# EAGLE design IN-12B Clock (EAGLE 8.1.0)
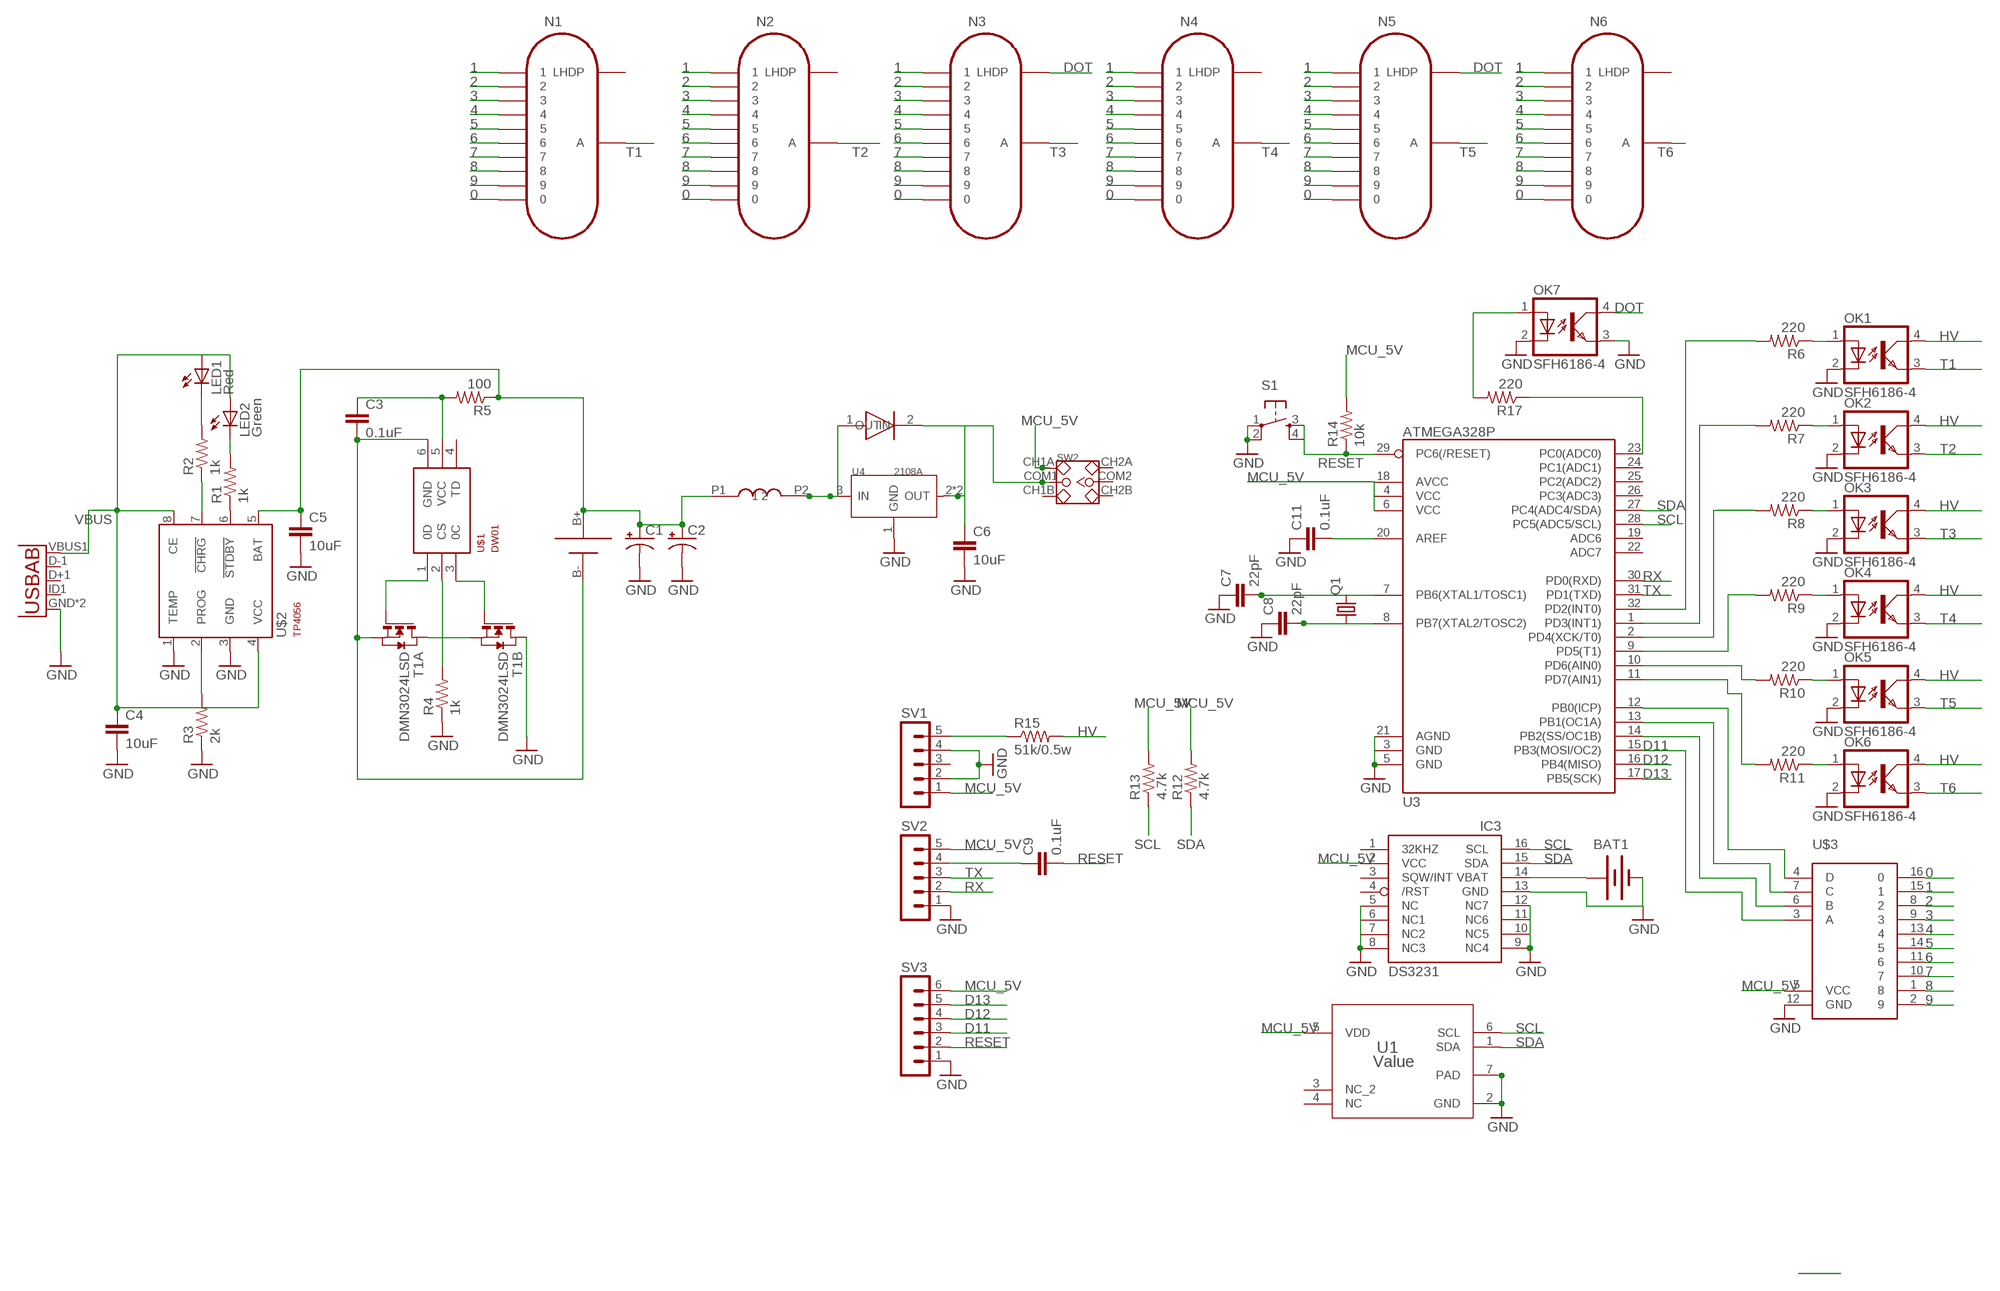
[diagram p0: schematic, sheet 1, part 1 of 2]
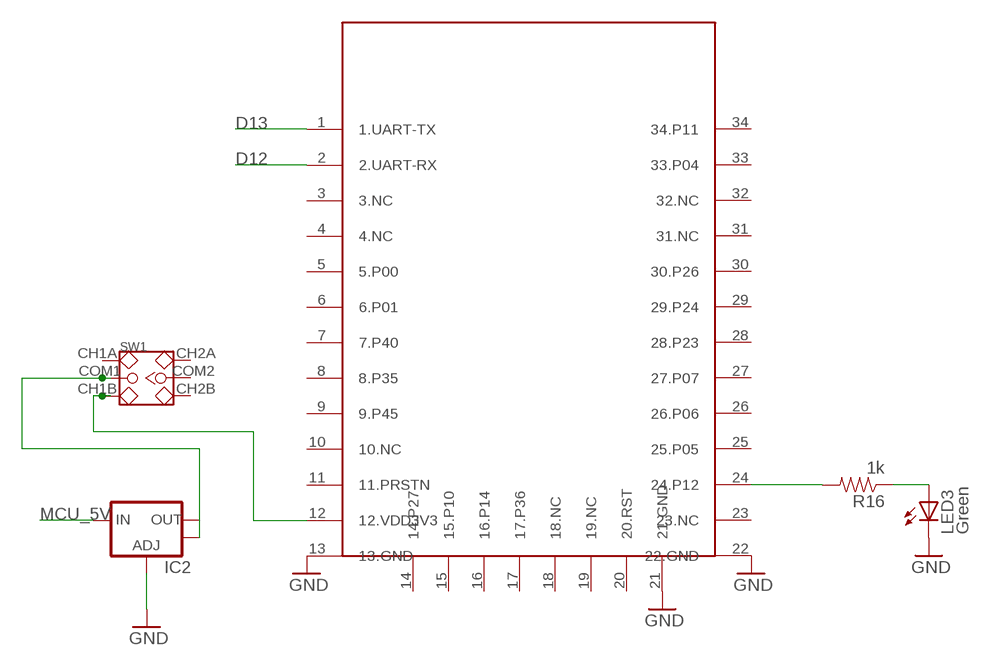
[diagram p1: schematic, sheet 1, part 2 of 2]

## Parts
BAT1  BATTERY20PTH  [BATTCOM_20MM_PTH]
C1  CAP_POLF80  [NIPPON_F80]
C2  CAP_POLF80  [NIPPON_F80]
C3  0.1uF  0.1UF-25V-5%(0603)  [0603-CAP]
C4  10uF  0.1UF-25V-5%(0603)  [0603-CAP]
C5  10uF  0.1UF-25V-5%(0603)  [0603-CAP]
C6  10uF  0.1UF-25V-5%(0603)  [0603-CAP]
C7  22pF  0.1UF-25V-5%(0603)  [0603-CAP]
C8  22pF  0.1UF-25V-5%(0603)  [0603-CAP]
C9  0.1uF  0.1UF-25V-5%(0603)  [0603-CAP]
C11  0.1uF  0.1UF-25V-5%(0603)  [0603-CAP]
IC2  V_REG_LM1117SOT223  [SOT223]
IC3  DS3231/SO  [SO16W]
LED1  Red  LEDCHIP-LED0805  [CHIP-LED0805]
LED2  Green  LEDCHIP-LED0805  [CHIP-LED0805]
LED3  Green  LEDCHIP-LED0805  [CHIP-LED0805]
N1  IN-12B  [IN-12]
N2  IN-12B  [IN-12]
N3  IN-12B  [IN-12]
N4  IN-12B  [IN-12]
N5  IN-12B  [IN-12]
N6  IN-12B  [IN-12]
OK1  SFH6186-4  [SMD4-7]
OK2  SFH6186-4  [SMD4-7]
OK3  SFH6186-4  [SMD4-7]
OK4  SFH6186-4  [SMD4-7]
OK5  SFH6186-4  [SMD4-7]
OK6  SFH6186-4  [SMD4-7]
OK7  SFH6186-4  [SMD4-7]
Q1  CRYSTALSM49  [SM49]
R1  1k  1.2MOHMS-1/10W-1%(0603)  [0603-RES]
R2  1k  1.2MOHMS-1/10W-1%(0603)  [0603-RES]
R3  2k  1.2MOHMS-1/10W-1%(0603)  [0603-RES]
R4  1k  1.2MOHMS-1/10W-1%(0603)  [0603-RES]
R5  100  1.2MOHMS-1/10W-1%(0603)  [0603-RES]
R6  220  1.2MOHMS-1/10W-1%(0603)  [0603-RES]
R7  220  1.2MOHMS-1/10W-1%(0603)  [0603-RES]
R8  220  1.2MOHMS-1/10W-1%(0603)  [0603-RES]
R9  220  1.2MOHMS-1/10W-1%(0603)  [0603-RES]
R10  220  1.2MOHMS-1/10W-1%(0603)  [0603-RES]
R11  220  1.2MOHMS-1/10W-1%(0603)  [0603-RES]
R12  4.7k  1.2MOHMS-1/10W-1%(0603)  [0603-RES]
R13  4.7k  1.2MOHMS-1/10W-1%(0603)  [0603-RES]
R14  10k  1.2MOHMS-1/10W-1%(0603)  [0603-RES]
R15  51k/0.5w  R-US_0207/12  [0207/12]
R16  1k  1.2MOHMS-1/10W-1%(0603)  [0603-RES]
R17  220  1.2MOHMS-1/10W-1%(0603)  [0603-RES]
S1  TAC_SWITCHSMD  [TACTILE_SWITCH_SMD]
SV1  MA05-1  [MA05-1]
SV2  MA05-1  [MA05-1]
SV3  MA06-1  [MA06-1]
SW1  SMD-TOGGLE-SWITCH-2CH(2X3P-7X3.5MM)  [SW6-2.54-SMD-7.0X3.5X1.5MM]
SW2  SMD-TOGGLE-SWITCH-2CH(2X3P-7X3.5MM)  [SW6-2.54-SMD-7.0X3.5X1.5MM]
T1  DMN3024LSD  [TSSOP-8]
U1  Value  HDC1080DMBR  [DMB0006A]
U2  USB""  [USB-MICRO-SMD]
U3  ATMEGA328P  ATMEGA328_SMT  [TQFP32-08]
U4  2108A  PMIC-CJA1117B-3.3(SOT-89)  [SOT-89]
U$1  DW01  [SOT23-6]
U$2  TP4056  [SOT23-8]
U$3  K155ID1  [DIL16-KIT]
U$4  SPP-CA  [SPP-CA]
U$5  22uH  CD54  [CD54]
U$6  SS14  SMA-SS34  [SMA-SS34]
U$7  18650SMD  [18650SMD]

## Nets
0: N1.0 N2.0 N3.0 N4.0 N5.0 N6.0 U$3.16
1: N1.1 N2.1 N3.1 N4.1 N5.1 N6.1 U$3.15
2: N1.2 N2.2 N3.2 N4.2 N5.2 N6.2 U$3.8
3: N1.3 N2.3 N3.3 N4.3 N5.3 N6.3 U$3.9
4: N1.4 N2.4 N3.4 N4.4 N5.4 N6.4 U$3.13
5: N1.5 N2.5 N3.5 N4.5 N5.5 N6.5 U$3.14
6: N1.6 N2.6 N3.6 N4.6 N5.6 N6.6 U$3.11
7: N1.7 N2.7 N3.7 N4.7 N5.7 N6.7 U$3.10
8: N1.8 N2.8 N3.8 N4.8 N5.8 N6.8 U$3.1
9: N1.9 N2.9 N3.9 N4.9 N5.9 N6.9 U$3.2
D11: SV3.3 U3.15(PB3(MOSI/OC2)) U$3.3(A)
D12: SV3.4 U3.16(PB4(MISO)) U$4.2(2.UART-RX)
D13: SV3.5 U3.17(PB5(SCK)) U$4.1(1.UART-TX)
DOT: N3.LHDP N5.LHDP OK7.4(COL)
GND: BAT1.2(-) C1.- C2.- C4.2 C5.2 C6.2 C7.1 C8.1 C11.1 IC2.1(ADJ) IC3.5(NC) IC3.6(NC1) IC3.7(NC2) IC3.8(NC3) IC3.9(NC4) IC3.10(NC5) IC3.11(NC6) IC3.12(NC7) IC3.13(GND) LED3.C OK1.2(C) OK2.2(C) OK3.2(C) OK4.2(C) OK5.2(C) OK6.2(C) OK7.2(C) OK7.3(EMIT) R3.1 R4.1 S1.1 S1.2 SV1.2 SV1.4 SV2.1 SV3.1 T1.8(B:D) U1.2(GND) U1.7(PAD) U2.GND U2.GND1(GND) U3.3(GND) U3.5(GND) U3.21(AGND) U4.1(GND) U$2.1(TEMP) U$2.3(GND) U$3.12(GND) U$4.13(13.GND) U$4.21(21.GND) U$4.22(22.GND)
HV: OK1.4(COL) OK2.4(COL) OK3.4(COL) OK4.4(COL) OK5.4(COL) OK6.4(COL) R15.2
MCU_5V: IC2.3(IN) IC3.2(VCC) R12.2 R13.2 R14.2 SV1.1 SV2.5 SV3.6 SW2.CH1A U1.5(VDD) U3.4(VCC) U3.6(VCC) U3.18(AVCC) U$3.5(VCC)
N$1: LED2.C R1.2
N$2: R1.1 U$2.6(!STDBY)
N$3: LED1.C R2.2
N$4: R2.1 U$2.7(!CHRG)
N$5: R3.2 U$2.2(PROG)
N$6: U4.3(IN) U$5.P2 U$6.1(IN)
N$7: C6.1 SW2.COM1 U4.2(OUT) U4.4(OUT) U$6.2(OUT)
N$8: T1.1(A:D) T1.6(B:S) T1.7(B:S)
N$9: T1.4(A:G) U$1.1(0D)
N$10: T1.5(B:G) U$1.3(0C)
N$11: R4.2 U$1.2(CS)
N$12: C3.2 T1.2(A:S) T1.3(A:S) U$1.6(GND) U$7.B-
N$13: C3.1 R5.2 U$1.5(VCC)
N$14: C1.+ C2.+ C5.1 R5.1 U$2.5(BAT) U$5.P1 U$7.B+
N$15: C7.2 Q1.2 U3.7(PB6(XTAL1/TOSC1))
N$16: C8.2 Q1.1 U3.8(PB7(XTAL2/TOSC2))
N$17: BAT1.1(+) IC3.14(VBAT)
N$18: C11.2 U3.20(AREF)
N$19: R15.1 SV1.5
N$22: OK1.1(A) R6.1
N$23: OK2.1(A) R7.1
N$24: OK3.1(A) R8.1
N$25: OK4.1(A) R9.1
N$26: OK5.1(A) R10.1
N$27: OK6.1(A) R11.1
N$28: R6.2 U3.32(PD2(INT0))
N$29: R7.2 U3.1(PD3(INT1))
N$30: R8.2 U3.2(PD4(XCK/T0))
N$31: R9.2 U3.9(PD5(T1))
N$32: R10.2 U3.10(PD6(AIN0))
N$33: R11.2 U3.11(PD7(AIN1))
N$34: U3.12(PB0(ICP)) U$3.4(D)
N$35: U3.13(PB1(OC1A)) U$3.7(C)
N$36: U3.14(PB2(SS/OC1B)) U$3.6(B)
N$37: R17.1 U3.23(PC0(ADC0))
N$38: IC2.2(OUT) IC2.4(OUT) SW1.COM1
N$39: SW1.CH1B U$4.12(12.VDD3V3)
N$40: OK7.1(A) R17.2
N$41: C9.1 SV2.4
N$42: R16.2 U$4.24(24.P12)
N$43: LED3.A R16.1
RESET: C9.2 R14.1 S1.3 S1.4 SV3.2 U3.29(PC6(/RESET))
RX: SV2.2 U3.30(PD0(RXD))
SCL: IC3.16(SCL) R13.1 U1.6(SCL) U3.28(PC5(ADC5/SCL))
SDA: IC3.15(SDA) R12.1 U1.1(SDA) U3.27(PC4(ADC4/SDA))
T1: N1.A OK1.3(EMIT)
T2: N2.A OK2.3(EMIT)
T3: N3.A OK3.3(EMIT)
T4: N4.A OK4.3(EMIT)
T5: N5.A OK5.3(EMIT)
T6: N6.A OK6.3(EMIT)
TX: SV2.3 U3.31(PD1(TXD))
VBUS: C4.1 LED1.A LED2.A U2.VBUS1(VBUS) U$2.4(VCC) U$2.8(CE)
Unconnected: IC3.1(32KHZ) IC3.3(SQW/INT) IC3.4(/RST) N1.LHDP N2.LHDP N4.LHDP N6.LHDP SV1.3 SW1.CH1A SW1.CH2A SW1.CH2B SW1.COM2 SW2.CH1B SW2.CH2A SW2.CH2B SW2.COM2 U1.3(NC_2) U1.4(NC) U2.D+1(D+) U2.D-1(D-) U2.ID1(USBID) U3.19(ADC6) U3.22(ADC7) U3.24(PC1(ADC1)) U3.25(PC2(ADC2)) U3.26(PC3(ADC3)) U$1.4(TD) U$4.3(3.NC) U$4.4(4.NC) U$4.5(5.P00) U$4.6(6.P01) U$4.7(7.P40) U$4.8(8.P35) U$4.9(9.P45) U$4.10(10.NC) U$4.11(11.PRSTN) U$4.14(14.P27) U$4.15(15.P10) U$4.16(16.P14) U$4.17(17.P36) U$4.18(18.NC) U$4.19(19.NC) U$4.20(20.RST) U$4.23(23.NC) U$4.25(25.P05) U$4.26(26.P06) U$4.27(27.P07) U$4.28(28.P23) U$4.29(29.P24) U$4.30(30.P26) U$4.31(31.NC) U$4.32(32.NC) U$4.33(33.P04) U$4.34(34.P11)

## Library data of the parts
BAT1 = SparkFun-Electromechanical:BATTERY: Battery Holders Various common sizes : AA, AAA, 20mm coin cell and 12mm coin cell. 20MM_4LEGS, BATT-10373
C1 C2 = SparkFun-Capacitors:CAP_POL: Capacitor Polarized These are standard SMD and PTH capacitors. Normally 10uF, 47uF, and 100uF in electrolytic and tantalum varieties. Always verify the external diameter of the through hole cap, it varies with capacity, voltage, and manufacturer. The EIA devices should be standard.
C3 C9 C11 = SparkFun-Capacitors:0.1UF-25V-5%(0603): CAP-08604; PROD_ID: CAP-08604
C4-C8 = SparkFun-Capacitors:0.1UF-25V-5%(0603): CAP-08604; PROD_ID: CAP-08604; VALUE: 0.1uF
IC2 = SparkFun-PowerIC:V_REG_LM1117: Voltage Regulator LM1117 Standard adjustable voltage regulator but in SMD form. Spark Fun Electronics SKU : COM-00595
IC3 = adafruit:DS3231
LED1-LED3 = adafruit:LED: LED OSRAM: - CHIPLED LG R971, LG N971, LY N971, LG Q971, LY Q971, LO R971, LY R971 LH N974, LH R974 LS Q976, LO Q976, LY Q976 LO Q996 - Hyper CHIPLED LW Q18S LB Q993, LB Q99A, LB R99A - SideLED LS A670, LO A670, LY A670, LG A670, LP A670 LB A673, LV A673, LT A673, LW A673 LH A674 LY A675 LS A676, LA A676, LO A676, LY A676, LW A676 LS A679, LY A679, LG A679 - Hyper Micro SIDELED® LS Y876, LA Y876, LO Y876, LY Y876 LT Y87S - SmartLED LW L88C, LW L88S LB L89C, LB L89S, LG L890 LS L89K, LO L89K, LY L89K LS L896, LA L896, LO L896, LY L896 - TOPLED LS T670, LO T670, LY T670, LG T670, LP T670 LSG T670, LSP T670, LSY T670, LOP T670, LYG T670 LG T671, LOG T671, LSG T671 LB T673, LV T673, LT T673, LW T673 LH T674 LS T676, LA T676, LO T676, LY T676, LB T676, LH T676, LSB T676, LW T676 LB T67C, LV T67C, LT T67C, LS T67K, LO T67K, LY T67K, LW E67C LS E67B, LA E67B, LO E67B, LY E67B, LB E67C, LV E67C, LT E67C LW T67C LS T679, LY T679, LG T679 LS T770, LO T770, LY T770, LG T770, LP T770 LB T773, LV T773, LT T773, LW T773 LH T774 LS E675, LA E675, LY E675, LS T675 LS T776, LA T776, LO T776, LY T776, LB T776 LHGB T686 LT T68C, LB T68C - Hyper Mini TOPLED® LB M676 - Mini TOPLED Santana® LG M470 LS M47K, LO M47K, LY M47K Source: http://www.osram.convergy.de/
N1-N6 = russian-nixies:IN-12B: IN-12B: medium numeric topview nixie tube
OK1-OK7 = optocoupler:SFH618?*: Optocoupler, Phototransistor Output, Low Input Current Source: Data sheet <http://www.vishay.com/docs/83673/sfh618.pdf>; MF: VISHAY/TELEFUNKEN; MPN: SFH6186-4; OC_FARNELL: 1469530; OC_NEWARK: 21H7753
Q1 = adafruit:CRYSTAL: CRYSTAL; OC_FARNELL: unknown; OC_NEWARK: unknown
R1-R14 R16 R17 = SparkFun-Resistors:1.2MOHMS-1/10W-1%(0603): RES-10055; PROD_ID: RES-10055; VALUE: 1.2M
R15 = resistor:R-US_: RESISTOR, American symbol
S1 = SparkFun-Electromechanical:TAC_SWITCH: Momentary Switch Button commonly used for reset or general input. Spark Fun Electronics SKU : COM-00097 SMT- SWCH-08247; PROD_ID: SWCH-08247
SV1 SV2 = con-lstb:MA05-1: PIN HEADER; OC_FARNELL: unknown; OC_NEWARK: unknown
SV3 = con-lstb:MA06-1: PIN HEADER; OC_FARNELL: unknown; OC_NEWARK: unknown
SW1 SW2 = Seeed-OPL-Switch:SMD-TOGGLE-SWITCH-2CH(2X3P-7X3.5MM): 311030005
T1 = FS8205A:DMN3024LSD: DUAL N-CHANNEL ENHANCEMENT MODE MOSFET data sheet <http://goo.gl/dRgboR> Dave.Calaway Eagle Library <https://goo.gl/Muy1Tr>
U1 = HDC1080:HDC1080DMBR; ALTERNATEPARTNUMBER: HDC1080DMBT; APPLICATION_BUILDNUMBER: *; COMPTYPE: IC; MANUFACTURER: Texas Instruments; MOUNTTYPE: SMT; PACKAGEREFERENCE: DMB0006A; PARTNUMBER: HDC1080DMBR; PIN_COUNT: 7; REFDES: RefDes; TYPE: TYPE
U2 = MicroUSB Long:USB: This is a USB AB connector that is compatible with USB OTG. i.e. this connector can serve as a host or device
U3 = SparkFun-DigitalIC:ATMEGA328_SMT: 32-Pin Atmega328 part Commonly used on Arduino compatible boards Available in QFP and QFN packages TQFP is IC-09069 QFN is non-stock; PROD_ID: IC-09069
U4 = Seeed-OPL-ic:PMIC-CJA1117B-3.3(SOT-89): 310030095; MPN: CJA1117B-3.3; VALUE: CJA1117B-3.3-SOT89
U$1 = DW01:DW01: The DW01-P battery protection IC is designed to protect lithium-ion/polymer battery from damage or degrading the lifetime due to overcharge, overdischarge, and/or overcurrent for one-cell lithium-ion/polymer battery powered systems, such as cellular phones. Data sheet <http://goo.gl/4y108d> Dave.Calaway Eagle Library <https://goo.gl/Muy1Tr>
U$2 = TP4056:TP4056: TP4056 Data sheet <http://goo.gl/J7k8TF> Dave.Calaway Eagle Library <https://goo.gl/Muy1Tr>
U$3 = Nixie:K155ID1
U$4 = SPP-CA:SPP-CA
U$5 = CD54:CD54
U$6 = SMA-SS34:SMA-SS34
U$7 = 18650SMD:18650SMD

## Board
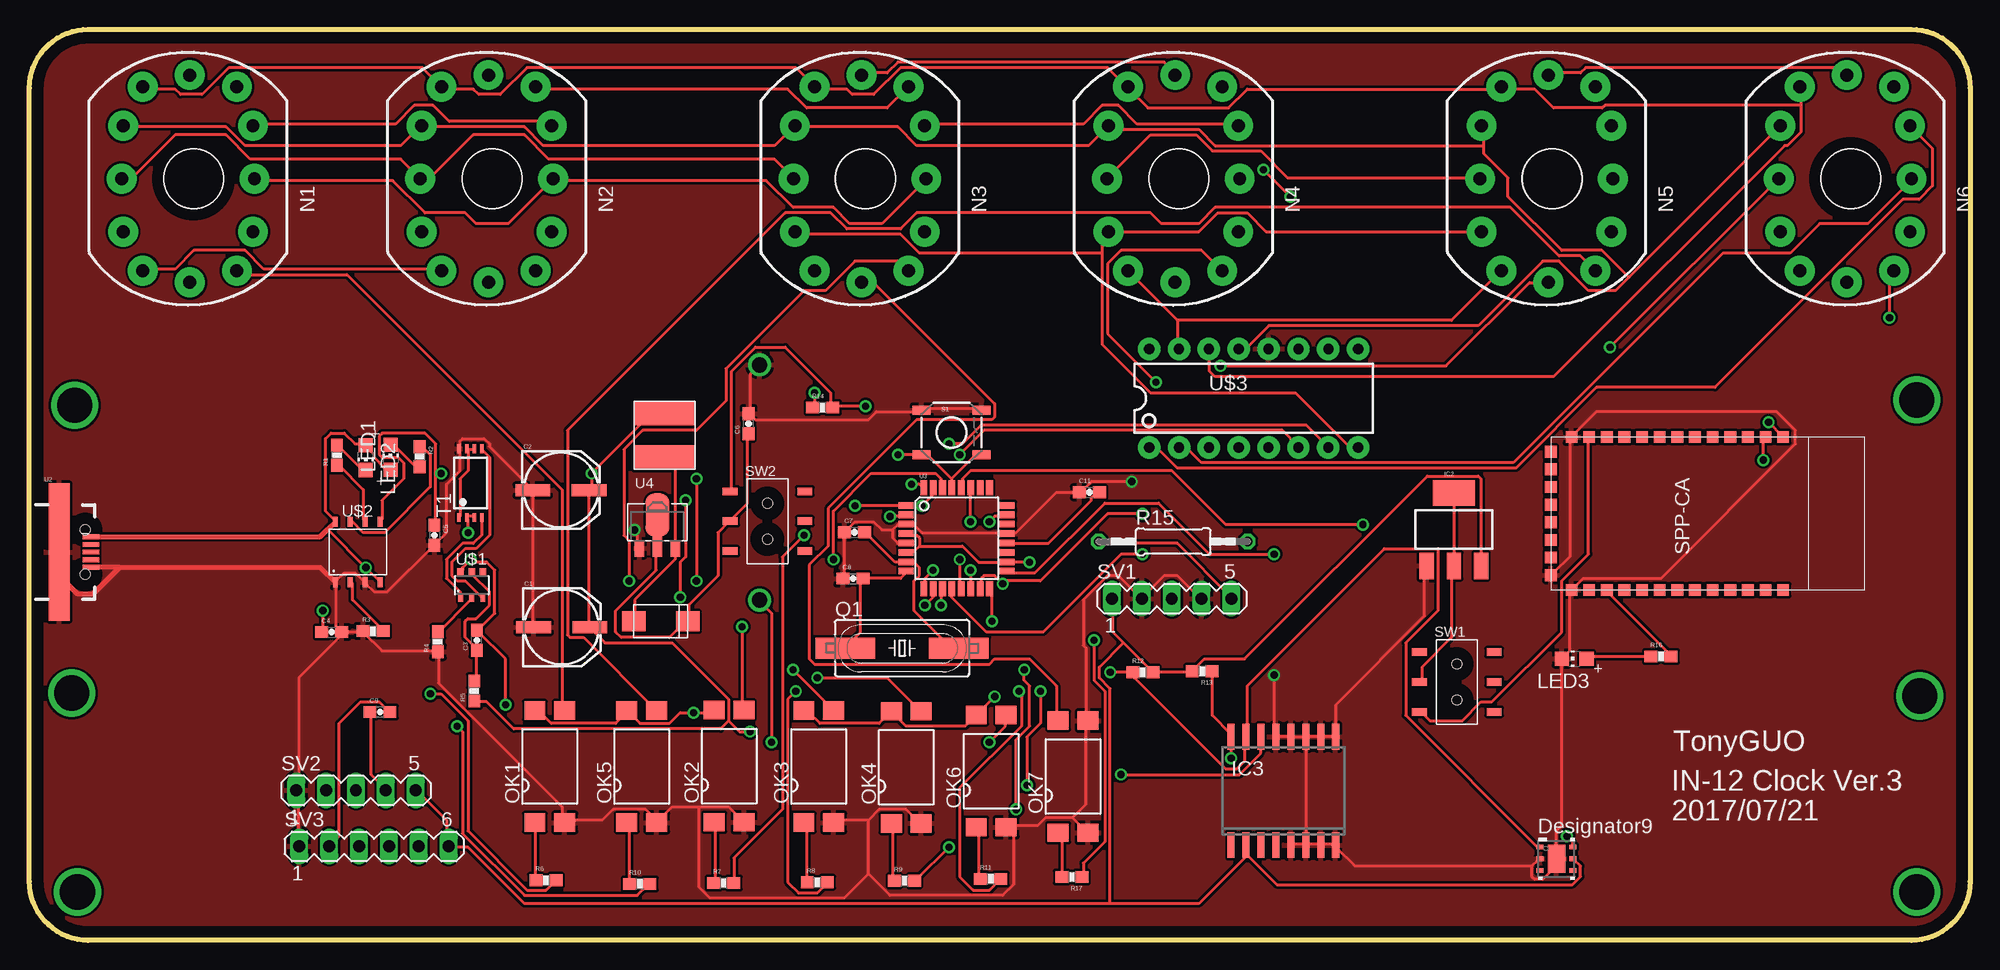
[diagram p2: board, top side]
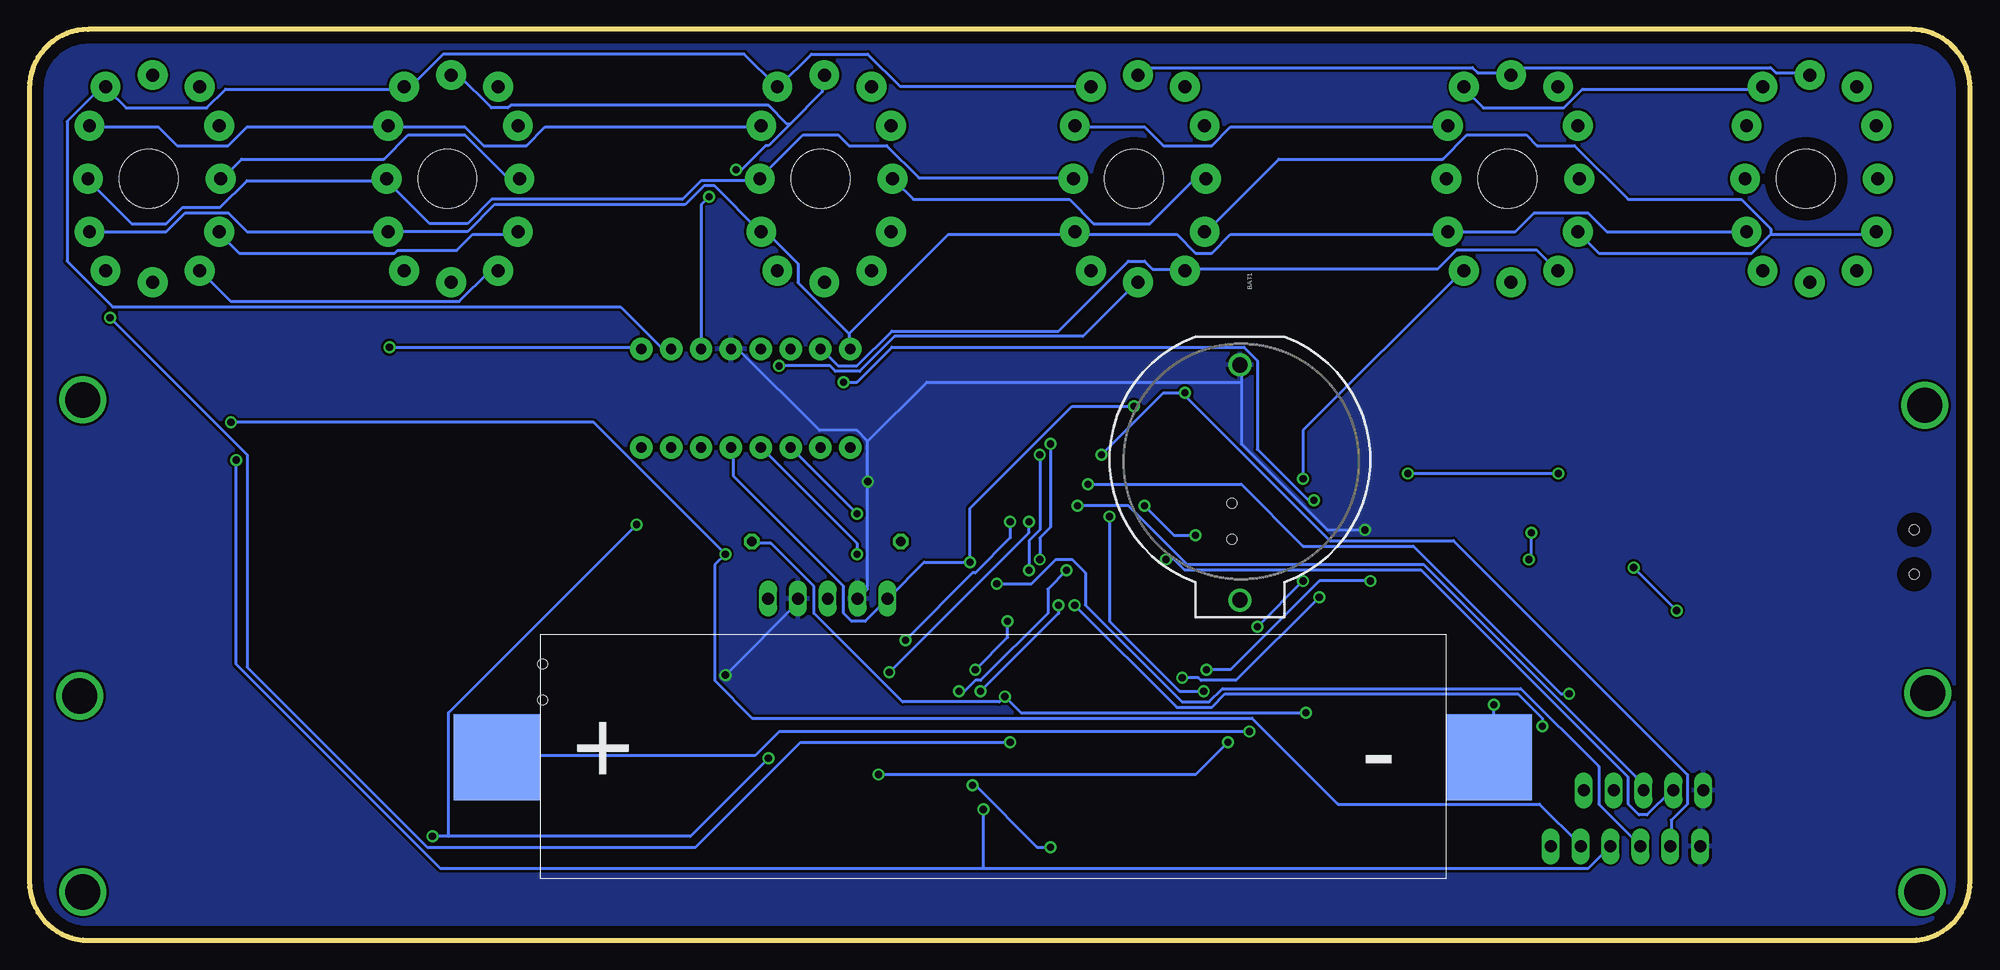
[diagram p3: board, bottom side, seen from below]

Size 165.1 x 77.47 mm. Coordinates in mm from the lower left corner, seen from the top.
Outline: 160.1,0 5,0 arc-90 0,5 0,72.47 arc-90 5,77.47 160.1,77.47 arc-90 165.1,72.47 165.1,5 arc-90 160.1,0
Copper layers (1*16): Top 0.035mm / dielectric 1.5mm / Bottom 0.035mm
Design rules "default": minimum track width 10mil, minimum drill 24mil, track to track 8mil, track to pad 8mil, pad to pad 8mil, via to via 8mil, smd to smd 8mil, copper to edge 40mil, drill to drill 8mil, minimum pad ring 10mil, minimum via ring 8mil, stop-mask expansion 4mil, vias tented up to drill 0mil, thermal gap 10mil

### Footprints (pad centres in the part's own frame; a part is rotated, then mirrored left to right if it is on the bottom)
BATTCOM_20MM_PTH = drill 1.3: 1 11.85,0; 2 -8.15,0
NIPPON_F80 = smd 2.95 x 1: + 2.4,0; - -2.4,0
0603-CAP = smd 1.1 x 1: 1 -0.85,0; 2 0.85,0
SOT223 = smd 1.219 x 2.235: 1 -2.311,-3.099; 2 0,-3.099; 3 2.311,-3.099 | smd 3.6 x 2.2: 4 0,3.099
SO16W = smd 0.6 x 2.2: 1 -4.445,-4.6; 2 -3.175,-4.6; 3 -1.905,-4.6; 4 -0.635,-4.6; 5 0.635,-4.6; 6 1.905,-4.6; 7 3.175,-4.6; 8 4.445,-4.6; 9 4.445,4.6; 10 3.175,4.6; 11 1.905,4.6; 12 0.635,4.6; 13 -0.635,4.6; 14 -1.905,4.6; 15 -3.175,4.6; 16 -4.445,4.6
CHIP-LED0805 = smd 1.2 x 1.2: A 0,-1.05; C 0,1.05
IN-12 = drill 1.1 pad 2.54: 0 5.048,-4.5; 1 -4.317,-7.817; 2 -6,-4.5; 3 -6.127,0; 4 -6,4.5; 5 -4.317,7.817; 6 -0.318,8.818; 7 3.683,7.817; 8 5.048,4.5; 9 5.175,0; A 3.683,-7.817; LHDP -0.318,-8.818 | hole 5: 0,0
SMD4-7 = smd 1.78 x 1.55: 1 -1.27,-4.77; 2 1.27,-4.77; 3 1.27,4.77; 4 -1.27,4.77
SM49 = smd 5.08 x 1.778: 1 -4.826,0; 2 4.826,0
0603-RES = smd 1.1 x 1: 1 -0.85,0; 2 0.85,0
0207/12 = drill 0.813 octagon: 1 -6.35,0; 2 6.35,0
TACTILE_SWITCH_SMD = smd 1.524 x 0.762: 1 -2.54,1.905; 2 2.54,1.905; 3 -2.54,-1.905; 4 2.54,-1.905
MA05-1 = drill 1.016 long: 1 -5.08,0; 2 -2.54,0; 3 0,0; 4 2.54,0; 5 5.08,0
MA06-1 = drill 1.016 long: 1 -6.35,0; 2 -3.81,0; 3 -1.27,0; 4 1.27,0; 5 3.81,0; 6 6.35,0
SW6-2.54-SMD-7.0X3.5X1.5MM = smd 1.27 x 0.635: CH1A -3.175,2.54; CH1B -3.175,-2.54; CH2A 3.175,2.54; CH2B 3.175,-2.54; COM1 -3.175,0; COM2 3.175,0 | hole 0.813: 0,1.524; 0,-1.524
TSSOP-8 = smd 0.3 x 0.75: 1 -0.975,-2.925; 2 -0.325,-2.925; 3 0.325,-2.925; 4 0.975,-2.925; 5 0.975,2.925; 6 0.325,2.925; 7 -0.325,2.925; 8 -0.975,2.925
DMB0006A = smd 0.6 x 0.4: 1 -1.4,1; 2 -1.4,0; 3 -1.4,-1; 4 1.4,-1; 5 1.4,0; 6 1.4,1 | smd 1.5 x 2.4: 7 0,0 | smd 0.5 x 0.5: V -0.5,0
USB-MICRO-SMD = smd 1.4 x 0.4: D+1 2.7,0; D-1 2.7,0.65; GND1 2.7,-1.3; ID1 2.7,-0.65; VBUS1 2.7,1.3 | smd 1.778 x 11.684: GND 0,0 | hole 0.85: 2.2,1.9; 2.2,-1.9
TQFP32-08 = smd 1.27 x 0.559: 1 -4.293,2.8; 2 -4.293,2; 3 -4.293,1.2; 4 -4.293,0.4; 5 -4.293,-0.4; 6 -4.293,-1.2; 7 -4.293,-2; 8 -4.293,-2.8; 17 4.293,-2.8; 18 4.293,-2; 19 4.293,-1.2; 20 4.293,-0.4; 21 4.293,0.4; 22 4.293,1.2; 23 4.293,2; 24 4.293,2.8 | smd 0.559 x 1.27: 9 -2.8,-4.293; 10 -2,-4.293; 11 -1.2,-4.293; 12 -0.4,-4.293; 13 0.4,-4.293; 14 1.2,-4.293; 15 2,-4.293; 16 2.8,-4.293; 25 2.8,4.293; 26 2,4.293; 27 1.2,4.293; 28 0.4,4.293; 29 -0.4,4.293; 30 -1.2,4.293; 31 -2,4.293; 32 -2.8,4.293
SOT-89 = smd 0.8 x 1.4: 1 -1.524,-1.905; 3 1.524,-1.905 | smd 0.8 x 1.9: 2 0,-1.651 | smd 2.032 x 3.65: 4 0,0.94
SOT23-6 = smd 0.4 x 0.55: 1 -0.95,-1.15; 2 0,-1.15; 3 0.95,-1.15 | smd 0.55 x 0.55: 4 0.95,1.15; 5 0,1.15; 6 -0.95,1.15
SOT23-8 = smd 0.42 x 0.835: 1 -1.905,-2.58; 2 -0.635,-2.58; 3 0.635,-2.58; 4 1.905,-2.58; 5 1.905,2.58; 6 0.635,2.58; 7 -0.635,2.58; 8 -1.905,2.58
DIL16-KIT = drill 0.864 pad 1.905: 1 -8.89,-4.191; 2 -6.35,-4.191; 3 -3.81,-4.191; 4 -1.27,-4.191; 5 1.27,-4.191; 6 3.81,-4.191; 7 6.35,-4.191; 8 8.89,-4.191; 9 8.89,4.191; 10 6.35,4.191; 11 3.81,4.191; 12 1.27,4.191; 13 -1.27,4.191; 14 -3.81,4.191; 15 -6.35,4.191; 16 -8.89,4.191
SPP-CA = smd 1 x 1: 1 0,19.75; 2 0,18.25; 3 0,16.75; 4 0,15.25; 5 0,13.75; 6 0,12.25; 7 0,10.75; 8 0,9.25; 9 0,7.75; 10 0,6.25; 11 0,4.75; 12 0,3.25; 13 0,1.75; 14 1.25,0; 15 2.75,0; 16 4.25,0; 17 5.75,0; 18 7.25,0; 19 8.75,0; 20 10.25,0; 21 11.75,0; 22 13,1.75; 23 13,3.25; 24 13,4.75; 25 13,6.25; 26 13,7.75; 27 13,9.25; 28 13,10.75; 29 13,12.25; 30 13,13.75; 31 13,15.25; 32 13,16.75; 33 13,18.25; 34 13,19.75
CD54 = smd 5.2 x 2.1: P1 2.6,-1; P2 2.6,-4.8
SMA-SS34 = smd 2 x 1.7: 1 0,-1.4; 2 4.6,-1.4
18650SMD = smd 7.3 x 7.3: B+ -3.7,10.3; B- 80.7,10.3

### Placement (x,y rotation side)
BAT1  62.12,40.78 270 bottom
C1  45.29,26.62 0 top
C2  45.22,38.28 0 top
C3  38.07,25.53 90 top
C4  25.73,26.21 0 top
C5  34.46,34.45 270 top
C6  61.18,43.94 90 top
C7  70.21,34.7 0 top
C8  70.06,30.76 0 top
C9  29.82,19.41 0 top
C11  90.17,38.1 0 top
IC2  121.19,34.94 0 top
IC3  106.68,12.7 0 top
LED1  30.73,41.08 0 top
LED2  28.61,41.05 180 top
LED3  131.42,23.95 90 top
N1  13.97,64.77 0 top
N2  39.37,64.77 0 top
N3  71.12,64.77 0 top
N4  97.79,64.77 0 top
N5  129.54,64.77 0 top
N6  154.94,64.77 0 top
OK1  44.27,14.78 0 top
OK2  59.53,14.81 0 top
OK3  67.15,14.78 0 top
OK4  74.6,14.71 0 top
OK5  52.09,14.78 0 top
OK6  81.82,14.38 0 top
OK7  88.79,13.92 0 top
Q1  74.24,24.85 0 top
R1  26.17,41.25 90 top
R2  33.2,41.14 270 top
R3  29.23,26.3 0 top
R4  34.75,25.39 90 top
R5  37.85,21.2 90 top
R6  43.95,5.11 0 top
R7  59.06,4.87 0 top
R8  67.03,4.94 0 top
R9  74.45,5.07 0 top
R10  51.92,4.79 0 top
R11  81.77,5.22 0 top
R12  94.72,22.79 0 top
R13  99.77,22.88 180 top
R14  67.48,45.31 0 top
R15  97.31,33.91 0 top
R16  138.8,24.14 0 top
R17  88.69,5.38 180 top
S1  78.45,43.18 0 top
SV1  97.18,29.06 0 top
SV2  27.78,12.75 0 top
SV3  29.32,7.98 0 top
SW1  121.43,21.97 0 top
SW2  62.79,35.64 0 top
T1  37.53,38.88 0 top
U1  129.91,6.93 0 top
U2  2.54,33.02 0 top
U3  78.88,34.19 0 top
U4  53.43,35.24 0 top
U$1  37.63,30.21 0 top
U$2  27.94,33.02 0 top
U$3  104.15,46.1 0 top
U$4  129.44,42.8 270 top
U$5  51.44,45.85 0 top
U$6  51.41,28.53 0 top
U$7  121.64,5.27 0 bottom

### Tracks (layer width: path | path; a pad name or v marks a point on that pad's centre or on a via)
0
  Bottom 0.254: N6.0 159.84,60.27 153.44,60.27 151.84,61.87 148.18,61.87 146.58,60.27 134.7,60.27 N5.0 134.47,60.27 127.84,60.27 125.55,62.56 109.32,62.56 107.72,64.16 106.81,64.16 102.92,60.27 N4.0 102.69,60.05 102.23,60.05 99.72,57.53 99.72,55.93 95.38,51.59 | N1.0 30.91,60.27 32.51,61.87 37.08,61.87 38.68,60.27 44.4,60.27 N2.0 44.63,60.05 62.92,60.05 64.52,58.45 65.89,58.45 67.49,60.05 75.95,60.05 N3.0 76.17,60.05 86.92,60.05 95.38,51.59 | 95.38,51.59 95.38,50.44 U$3.16
1
  Top 0.254: N1.1 9.88,57.07 12.4,57.07 14,58.67 18.34,58.67 19.94,57.07 35.03,57.07 N2.1 | 97.66,52.73 97.66,50.44 U$3.15 | 97.66,52.73 93.55,56.84 N4.1 | 97.66,52.73 120.98,52.73 125.09,56.84 N5.1
  Bottom 0.254: N2.1 35.26,57.07 36.86,58.67 43.71,58.67 45.31,57.07 66.8,57.07 N3.1 67.03,57.07 69.55,57.07 70.23,57.76 71.6,57.76 77.55,51.82 91.72,51.82 94.69,48.84 96.29,48.84 97.66,50.22 U$3.15 | N5.1 125.32,56.84 126.01,56.84 128.52,54.33 147.96,54.33 150.47,56.84 N6.1
2
  Top 0.254: 91.26,58.45 91.26,59.59 91.72,60.05 N4.2 91.95,60.27 99.49,60.27 101.09,61.87 103.61,61.87 105.21,60.27 123.5,60.27 N5.2 | 91.26,58.45 91.26,50.67 95.38,46.56 107.72,46.56 112.29,41.99 112.98,41.99 U$3.8 | 91.26,58.45 75.72,58.45 74.12,60.05 65.2,60.05 N3.2
  Bottom 0.254: N5.2 123.72,60.05 127.38,60.05 128.75,58.67 133.78,58.67 134.01,58.45 147.27,58.45 148.87,60.05 N6.2 | 16.97,60.05 8.05,60.05 N1.2 | 16.97,60.05 18.57,58.45 31.6,58.45 33.2,60.05 N2.2 | 16.97,60.05 16.97,60.5 19.48,63.02 29.08,63.02 33.66,67.59 36.86,67.59 37.77,68.5 42.8,68.5 44.86,66.45 58.8,66.45 64.97,60.27 N3.2
3  (via drill 0.61)
  Top 0.254: v134.47,50.44 148.64,64.62 N6.3 | N1.3 8.05,64.85 8.74,64.85 12.4,68.5 16.74,68.5 18.8,66.45 31.6,66.45 33.2,64.85 N2.3 33.43,64.85 34.11,64.85 37.77,68.5 42.11,68.5 44.17,66.45 63.37,66.45 64.97,64.85 N3.3 | N5.3 123.27,64.85 107.04,64.85 104.75,67.13 100.63,67.13 99.26,68.5 95.38,68.5 91.72,64.85 N4.3
  Bottom 0.254: v134.47,50.44 113.21,50.44 U$3.9 | N5.3 123.5,64.85 124.41,64.85 128.07,68.5 132.87,68.5 134.93,66.45 147.04,66.45 148.64,64.85 N6.3 | N3.3 65.2,64.62 66.12,64.62 69.77,60.96 74.57,60.96 76.63,63.02 89.89,63.02 91.49,64.62 N4.3
4
  Top 0.254: 136.07,56.39 148.87,69.19 N6.4 | 136.07,56.39 134.93,55.25 132.64,55.25 130.12,57.76 128.75,57.76 123.27,52.27 105.44,52.27 103.61,50.44 102.92,50.44 U$3.13 | 123.72,67.59 123.72,66.9 125.78,64.85 125.78,63.25 130.35,58.67 133.78,58.67 136.07,56.39 | 123.72,67.59 123.72,69.19 N5.4 | N1.4 8.05,69.19 16.74,69.19 18.34,67.59 31.6,67.59 33.2,69.19 N2.4 33.43,69.19 42.11,69.19 43.71,67.59 63.37,67.59 64.97,69.19 N3.4 65.2,69.19 73.89,69.19 75.49,67.59 90.12,67.59 91.72,69.19 N4.4 91.95,69.19 92.18,68.96 99.49,68.96 100.86,67.59 123.72,67.59
5
  Top 0.254: 150.7,71.02 150.7,72.39 N6.5 | 150.7,71.02 150.7,68.73 149.56,67.59 149.33,67.59 129.67,47.93 100.86,47.93 100.41,48.39 100.41,50.22 U$3.14 | 150.7,71.02 134.01,71.02 133.78,70.79 129.67,70.79 128.07,72.39 125.32,72.39 N5.5 125.09,72.39 103.61,72.39 102.01,70.79 95.15,70.79 93.55,72.39 N4.5 93.32,72.62 91.72,74.22 74.12,74.22 71.83,71.93 70,71.93 69.55,72.39 67.03,72.39 N3.5 66.8,72.62 65.2,74.22 42.34,74.22 40.06,71.93 38.23,71.93 37.77,72.39 35.26,72.39 N2.5 35.03,72.62 33.43,74.22 16.97,74.22 14.68,71.93 12.85,71.93 12.4,72.39 9.88,72.39 N1.5
6  (via drill 0.61)
  Top 0.254: N5.6 129.44,73.76 131.95,73.76 132.41,74.22 154.13,74.22 154.58,73.76 N6.6 | v104.98,65.53 v107.26,63.25 | N3.6 70.92,73.76 72.97,73.76 73.89,74.68 96.52,74.68 97.43,73.76 N4.6
  Bottom 0.254: N1.6 13.77,73.76 16.51,73.76 16.97,74.22 38.46,74.22 38.91,73.76 N2.6 39.14,73.76 41.89,73.76 42.34,74.22 70.23,74.22 70.69,73.76 N3.6 | v107.26,63.25 107.95,62.56 107.95,50.44 U$3.11 | v104.98,65.53 104.52,65.53 102.46,67.59 102.23,67.59 100.41,69.42 | 100.41,69.42 97.66,72.16 97.66,73.53 N4.6 | 100.41,69.42 100.63,69.42 102.23,71.02 124.18,71.02 124.41,70.79 125.78,70.79 128.52,73.53 129.21,73.53 N5.6
7
  Top 0.254: N2.7 43.26,72.39 64.52,72.39 66.12,70.79 72.97,70.79 74.57,72.39 N3.7
  Bottom 0.254: U$3.10 110.69,50.44 111.38,50.44 114.81,53.87 158.01,53.87 161.9,57.76 161.9,69.65 159.16,72.39 158.7,72.39 N6.7 158.47,72.39 156.87,70.79 150.01,70.79 148.41,72.39 133.33,72.39 N5.7 133.1,72.62 132.64,72.62 129.9,75.36 104.29,75.36 101.55,72.62 N4.7 101.32,72.62 98.58,75.36 93.78,75.36 91.03,72.62 74.8,72.62 N3.7 | N1.7 17.65,72.39 32.97,72.39 34.57,70.79 41.43,70.79 43.03,72.39 N2.7
8
  Top 0.254: N1.8 19.03,69.42 31.14,69.42 32.74,71.02 34.34,71.02 35.71,69.65 44.17,69.65 44.4,69.42 N2.8 | N3.8 76.17,69.42 89.66,69.42 91.26,71.02 92.63,71.02 94.23,69.42 102.69,69.42 N4.8 | U$3.1 95.38,41.76 96.06,41.76 97.66,40.16 126.47,40.16 133.33,47.02 143.38,47.02 159.38,63.02 160.76,63.02 161.9,64.16 161.9,67.36 160.07,69.19 N6.8
  Bottom 0.254: N2.8 44.63,69.19 62.92,69.19 64.52,67.59 68.63,67.59 70.23,69.19 75.95,69.19 N3.8 | N6.8 159.84,69.19 154.13,69.19 152.53,67.59 148.18,67.59 146.58,69.19 134.7,69.19 N5.8 134.47,69.19 128.07,69.19 126.47,67.59 122.81,67.59 121.21,69.19 102.92,69.19 N4.8
9
  Top 0.254: U$3.2 97.89,41.76 98.58,41.76 99.72,40.62 126.24,40.62 144.07,58.45 149.78,58.45 152.3,60.96 156.41,60.96 160.07,64.62 N6.9 | N1.9 19.25,64.62 30.91,64.62 33.66,61.87 37.08,61.87 38,60.96 40.74,60.96 44.4,64.62 N2.9 44.63,64.62 62.69,64.62 64.97,62.33 68.4,62.33 69.77,60.96 72.52,60.96 76.17,64.62 N3.9
  Bottom 0.254: N6.9 160.07,64.62 156.41,60.96 153.44,60.96 152.07,62.33 148.87,62.33 146.58,64.62 134.93,64.62 N5.9 134.7,64.62 131.04,60.96 127.84,60.96 125.78,63.02 109.55,63.02 107.95,64.62 103.15,64.62 N4.9 102.92,64.85 99.26,68.5 96.29,68.5 95.38,67.59 92.18,67.59 89.43,64.85 76.4,64.85 N3.9
D11  (via drill 0.61)
  Top 0.254: 82.8,30.56 86,30.56 91.72,36.27 v94.69,36.27 | 82.8,30.56 82.58,30.56 82.12,31.01 81.2,31.01 80.97,30.79 80.97,30.1 U3.15 | 82.8,30.56 v82.8,30.33
  Bottom 0.254: v94.69,36.27 100.18,41.76 U$3.3 | v82.8,30.33 79.83,30.33 77.78,32.38 76.4,32.38 75.26,31.24 75.26,28.5 67.03,20.27 64.75,20.27 63.6,21.41 38.23,21.41 31.6,14.78 31.6,11.58 28.17,8.15 SV3.3
D12  (via drill 0.61)
  Top 0.254: v147.5,40.84 147.5,42.67 U$4.2 | v81.89,27.13 81.89,29.87 U3.16 | v84.63,23.01 84.63,22.1 85.09,21.64 85.09,18.21 83.95,17.07 v83.95,11.12
  Bottom 0.254: v147.5,40.84 147.5,23.47 130.12,6.1 83.95,6.1 | 83.95,6.1 32.51,6.1 30.68,7.93 SV3.4 | v81.89,27.13 81.89,25.76 v84.63,23.01 | 83.95,6.1 v83.95,11.12
D13  (via drill 0.61)
  Top 0.254: v147.96,44.04 149.1,42.9 U$4.1 | v105.89,32.84 100.41,32.84 96.06,37.19 91.49,37.19 85.55,31.24 83.26,31.24 U3.17
  Bottom 0.254: v147.96,44.04 117.09,44.04 v105.89,32.84 106.81,31.93 106.81,22.1 103.61,18.9 61.09,18.9 53.77,11.58 36.63,11.58 33.2,8.15 SV3.5
DOT  (via drill 0.61)
  Top 0.254: OK7.4 87.38,18.9 87.38,21.64 85.09,23.93 82.12,23.93 81.66,23.47 66.8,23.47 66.34,23.93 66.34,31.93 67.95,33.53 67.95,36.73 75.49,44.27 81.89,44.27 82.12,44.5 82.12,45.64 71.83,55.93 70.92,55.93 N3.LHDP | v101.32,48.84 120.52,48.84 127.61,55.93 129.21,55.93 N5.LHDP
  Bottom 0.254: v101.32,48.84 96.98,48.84 96.52,48.39 94.46,48.39 91.49,51.36 75.49,51.36 70.92,55.93 N3.LHDP
GND  (via drill 0.61)
  Top 0.254: IC2.1 118.69,31.7 118.69,27.58 111.15,20.04 111.15,17.53 IC3.9 110.92,17.3 110.01,17.3 IC3.10 109.78,17.3 108.64,17.3 | U$4.21 129.67,31.24 131.04,32.61 131.04,42.67 U$4.13 131.27,42.9 133.33,44.96 148.64,44.96 150.24,43.36 150.24,42.22 138.81,30.79 132.18,30.79 131.27,29.87 U$4.22 131.04,29.64 131.04,24.61 130.58,24.15 LED3.C 130.35,23.93 130.35,9.75 129.9,9.3 129.9,7.47 130.12,7.24 130.12,7.01 U1.7 130.12,6.78 130.12,6.55 128.75,5.18 128.07,5.18 127.84,5.41 127.84,6.33 | IC3.5 107.49,8.15 108.41,8.15 IC3.6 108.64,8.15 | 127.84,6.33 128.3,6.78 U1.2 | 127.84,6.33 112.75,6.33 111.15,7.93 IC3.8 110.92,8.15 110.01,8.15 IC3.7 109.78,8.15 108.64,8.15 | 108.64,8.15 108.64,17.3 | 108.64,17.3 IC3.11 108.41,17.3 107.49,17.3 IC3.12 107.26,17.3 106.12,17.3 IC3.13 105.89,17.53 v105.89,22.55 | C1.- 42.8,26.67 42.8,38.1 C2.- 42.8,38.33 39.14,41.99 39.14,42.22 38.68,42.67 36.86,42.67 36.63,42.44 36.63,41.99 T1.8 36.63,41.76 36.63,39.93 35.48,38.79 35.48,34.67 34.57,33.76 C5.2 34.34,33.53 30.46,29.64 29.31,29.64 28.63,30.33 U$2.3 28.4,30.56 27.71,31.24 26.8,31.24 26.11,30.56 U$2.1 26.11,30.33 26.11,26.67 26.57,26.21 C4.2 | 56.97,11.35 54.69,11.35 53.54,10.21 OK5.2 53.31,10.21 52.4,11.12 49.66,11.12 48.74,10.21 45.54,10.21 OK1.2 45.31,10.21 45.31,11.35 34.8,21.87 34.8,24.38 R4.1 34.57,24.61 30,24.61 28.4,26.21 R3.1 28.17,26.21 26.8,26.21 C4.2 | 56.97,11.35 59.49,11.35 60.63,10.21 OK2.2 | SV3.1 22.91,8.15 22.91,12.72 SV2.1 22.91,12.95 22.91,22.33 26.57,25.98 C4.2 | S1.2 80.97,45.19 75.95,45.19 S1.1 75.72,44.96 72.06,44.96 71.37,44.27 61.77,44.27 61.32,44.73 C6.2 61.32,44.96 61.32,48.16 62,48.84 BAT1.2
  Top 0.254: v51.49,34.9 51.71,34.67 51.71,33.53 U4.1 | 71.37,10.21 68.63,10.21 OK3.2 | 71.37,10.21 72.29,11.12 74.57,11.12 75.72,9.98 OK4.2 | 83.72,9.75 85.78,9.75 86.46,10.44 88.75,10.44 | 83.72,9.75 83.26,9.75 OK6.2 83.72,9.75 | 88.75,10.44 89.89,9.3 OK7.2 | 88.75,10.44 89.89,11.58 89.89,18.67 OK7.3 89.89,18.9 89.89,24.84 89.66,25.07 89.66,28.96 91.72,31.01 92.63,31.01 94.46,29.18 SV1.2 94.69,29.18 96.52,31.01 97.66,31.01 99.49,29.18 SV1.4 | 71.37,5.64 71.37,10.21 | 71.37,5.64 73.2,3.81 82.8,3.81 83.72,4.72 83.72,9.75 | 73.43,34.9 73.43,34.21 73.89,33.76 74.57,33.76 U3.5 | 73.43,34.9 73.89,35.36 74.57,35.36 U3.3 74.8,35.36 75.26,35.36 75.95,34.67 83.03,34.67 U3.21 83.26,34.67 83.95,34.67 87.38,38.1 C11.1 89.43,38.1 90.35,39.01 v93.78,39.01 | C8.1 69.32,30.79 69.32,34.67 C7.1 69.55,34.9 70.23,35.59 71.83,35.59 72.52,34.9 73.43,34.9 | 56.97,11.35 56.97,4.5 57.89,3.58 69.32,3.58 71.37,5.64
  Top 0.406: 7.67,31.72 U2.GND1 | U$2.1 24.76,31.72 8.13,31.72 7.67,31.72 | U2.GND 3.1,32.46 3.1,30.44 4.06,29.48 5.42,29.48 7.67,31.72
  Bottom 0.254: v51.49,34.9 54.69,34.9 62,42.22 62,47.47 | 62,47.47 62,48.84 BAT1.2 | 93.78,42.44 94.69,43.36 97.89,43.36 104.75,50.22 105.21,50.22 U$3.12 | 93.78,42.44 v93.78,39.01 93.78,29.87 94.46,29.18 SV1.2 | 62,47.47 88.75,47.47 93.78,42.44 | v105.89,22.55 99.49,28.96 SV1.4
  pour Bottom: -2.54,78.74 166.37,78.74 166.37,-3.81 -2.54,-3.81
  pour Top: 1.27,78.74 166.37,78.74 166.37,-3.81 -2.54,-3.81 -2.54,78.74
HV  (via drill 0.61)
  Top 0.254: OK1.4 43.03,19.36 43.48,19.36 44.4,18.44 49.89,18.44 50.8,19.36 OK5.4 51.03,19.36 51.94,18.44 54.46,18.44 55.37,19.36 v56.52,19.36 58.12,19.36 OK2.4 | OK3.4 65.89,19.36 66.34,19.36 67.26,18.44 72.29,18.44 73.2,19.36 OK4.4 73.43,19.36 74.57,18.21 79.6,18.21 80.52,19.13 OK6.4 80.75,19.36 v82.12,20.73
  Bottom 0.254: R15.2 103.61,33.76 102.01,33.76 98.35,30.1 98.35,27.81 90.81,20.27 82.58,20.27 v82.12,20.73 80.75,19.36 v56.52,19.36
MCU_5V  (via drill 0.61)
  Top 0.254: SW2.CH1A 59.72,38.33 59.72,48.39 61.77,50.44 64.29,50.44 68.17,46.56 68.17,45.41 R14.2 68.4,45.41 v71.14,45.41 | 75.72,33.53 75.26,33.07 74.8,33.07 U3.6 | 75.72,33.53 75.72,34.21 75.49,34.44 74.8,34.44 U3.4 | 75.72,33.53 79.38,33.53 80.75,32.16 83.03,32.16 U3.18 83.26,32.16 v85.09,32.16 | IC2.3 123.5,31.93 123.5,39.24 123.27,39.47 118.92,39.47 103.38,23.93 99.95,23.93 99.03,23.01 R13.2 98.81,22.78 95.61,22.78 R12.2 95.38,23.01 93.09,25.3 | 93.09,25.3 92.18,26.21 92.18,28.96 SV1.1 | SV2.5 32.97,12.72 35.48,10.21 35.48,8.15 SV3.6 35.71,7.93 37.31,7.93 42.11,3.12 91.95,3.12 | 103.61,7.24 106.12,4.72 131.27,4.72 131.95,5.41 131.95,6.33 131.5,6.78 U1.5 | 103.61,7.24 103.61,7.93 IC3.2 103.61,7.24 | 91.95,3.12 99.49,3.12 103.61,7.24 | 93.09,25.3 91.03,23.24 91.03,22.33 91.95,21.41 91.95,3.12
  Bottom 0.254: U$3.5 105.21,41.76 105.21,39.47 95.83,30.1 95.83,27.81 95.15,27.13 94,27.13 92.18,28.96 SV1.1 91.95,29.18 88.98,32.16 v85.09,32.16 85.09,36.73 76.4,45.41 v71.14,45.41
N$1
  Top 0.254: R1.2 26.34,41.99 28.4,39.93 LED2.C
N$2
  Top 0.254: U$2.6 28.4,35.81 28.4,38.33 26.34,40.39 R1.1
N$3
  Top 0.254: R2.2 33.2,40.39 32.74,40.39 30.91,42.22 LED1.C
N$4
  Top 0.254: U$2.7 27.48,35.59 28.4,34.67 30.23,34.67 34.11,38.56 34.11,41.3 33.43,41.99 R2.1
N$5
  Top 0.254: U$2.2 27.48,30.33 27.48,28.96 30,26.44 R3.2
N$6
  Top 0.254: U$5.P2 54.23,40.84 54.92,40.16 54.92,33.53 U4.3 54.92,33.3 54.92,32.38 51.49,28.96 51.49,27.36 U$6.1
N$7
  Top 0.254: U4.4 53.54,36.04 53.54,33.76 U4.2 53.31,33.53 53.31,31.47 49.89,28.04 49.89,26.21 50.34,25.76 54.46,25.76 55.83,27.13 U$6.2 56.06,27.36 56.06,28.5 58.57,31.01 58.57,34.67 59.49,35.59 SW2.COM1 59.72,35.81 61.09,37.19 61.09,42.9 C6.1
N$8
  Top 0.254: 37.31,41.76 37.31,39.93 36.63,39.24 36.63,36.04 T1.1 | 37.31,41.76 37.77,41.76 T1.6 | 37.31,41.76 T1.7
N$9
  Top 0.254: U$1.1 36.63,29.18 36.63,29.64 35.48,30.79 35.48,32.38 36.86,33.76 37.77,33.76 38.46,34.44 38.46,35.81 T1.4
N$10
  Top 0.254: U$1.3 38.46,29.18 37.08,30.56 36.4,30.56 35.94,31.01 35.94,32.16 37.08,33.3 38,33.3 39.14,34.44 39.14,41.07 38.46,41.76 T1.5
N$11
  Top 0.254: U$1.2 37.54,28.96 34.8,26.21 R4.2
N$12  (via drill 0.61)
  Top 0.254: T1.3 37.77,36.04 37.31,36.04 T1.2 37.31,35.81 v37.31,34.67 | 37.54,32.16 38.91,32.16 39.6,31.47 39.6,27.81 38.23,26.44 C3.2 38.23,26.21 40.51,23.93 v40.51,20.04 | 37.54,32.16 37.31,32.16 36.86,31.7 36.86,31.47 U$1.6 | 37.54,32.16 v37.54,32.38
  Bottom 0.254: v37.31,34.67 37.31,32.61 v37.54,32.38 | v40.51,20.04 40.51,15.93 40.74,15.7 U$7.B-
N$13
  Top 0.254: U$1.5 37.77,31.24 37.77,31.01 39.14,29.64 39.14,28.5 38,27.36 37.31,27.36 37.08,27.13 37.08,25.76 38,24.84 C3.1 38,24.61 38,22.1 R5.2
N$14  (via drill 0.61)
  Top 0.254: 34.57,39.7 34.57,35.36 C5.1 | 34.57,39.7 34.57,42.22 33.66,43.13 30,43.13 29.77,42.9 29.77,41.3 30,41.07 31.37,41.07 31.83,40.62 31.83,39.24 30,37.41 30,35.81 U$2.5 | U$5.P1 54,44.73 52.86,44.73 v47.83,39.7 47.83,38.33 C2.+ 47.6,38.1 47.6,26.67 C1.+ 47.83,26.44 48.97,25.3 54.69,25.3 59.49,20.5 59.49,18.67 | v35.03,39.7 34.57,39.7 | 59.49,18.67 58.8,17.98 41.2,17.98 38.91,20.27 38,20.27 R5.1 | v61.32,17.75 60.4,17.75 59.49,18.67
  Bottom 0.254: v47.83,39.7 v35.03,39.7 | v61.32,17.75 101.32,17.75 103.38,15.7 125.32,15.7 U$7.B+
N$15
  Top 0.254: C7.2 71.14,34.67 73.66,32.16 74.57,32.16 U3.7 74.8,32.16 75.26,32.16 75.72,31.7 75.72,31.01 75.26,30.56 75.26,28.04 78.23,25.07 78.92,25.07 Q1.2
N$16
  Top 0.254: U3.8 74.57,31.24 74.12,30.79 70.92,30.79 C8.2 70.69,30.56 70.69,26.21 69.55,25.07 Q1.1
N$17  (via drill 0.61)
  Top 0.254: v92.86,14.1 102.92,14.1 104.75,15.93 104.75,17.3 IC3.14 | v63.14,16.84 63.14,27.81 62.23,28.73 BAT1.1
  Bottom 0.254: v92.86,14.1 65.89,14.1 v63.14,16.84
N$18
  Top 0.254: C11.2 90.81,38.1 90.35,37.64 90.35,37.41 86.69,33.76 83.26,33.76 U3.20
N$19
  Top 0.254: R15.1 91.03,33.76 97.66,33.76 102.23,29.18 SV1.5
N$22
  Top 0.254: R6.1 43.03,5.18 43.03,9.98 OK1.1
N$23
  Top 0.254: R7.1 58.34,4.95 58.34,9.98 OK2.1
N$24
  Top 0.254: R8.1 66.12,4.95 66.12,9.75 65.89,9.98 OK3.1
N$25
  Top 0.254: R9.1 73.43,5.18 73.43,9.75 OK4.1
N$26
  Top 0.254: R10.1 51.03,4.95 51.03,9.98 OK5.1
N$27
  Top 0.254: R11.1 80.75,5.41 80.75,9.53 OK6.1
N$28  (via drill 0.61)
  Top 0.254: v34.11,20.95 35.03,20.95 37.31,18.67 37.31,9.3 42.34,4.27 43.94,4.27 44.63,4.95 R6.2 | v75.03,38.79 75.72,38.79 75.95,38.56 U3.32
  Bottom 0.254: v34.11,20.95 34.8,20.95 47.37,33.53 56.74,33.53 62,38.79 v75.03,38.79
N$29  (via drill 0.61)
  Top 0.254: v65.89,34.44 64.06,32.61 64.06,11.12 59.94,7.01 59.94,4.95 R7.2 | v70.23,36.96 74.57,36.96 U3.1
  Bottom 0.254: v65.89,34.44 67.72,34.44 v70.23,36.96
N$30  (via drill 0.61)
  Top 0.254: v65.2,21.18 64.52,20.5 64.52,4.95 65.43,4.04 67.03,4.04 67.72,4.72 R8.2 | v73.2,36.04 74.57,36.04 U3.2
  Bottom 0.254: v65.2,21.18 67.26,21.18 73.2,27.13 v73.2,36.04
N$31  (via drill 0.61)
  Top 0.254: v78.23,7.93 75.49,5.18 R9.2 | v84.86,13.18 84.86,17.3 86,18.44 v86,21.18 | v76.86,31.47 76.17,30.79 76.17,30.1 U3.9
  Bottom 0.254: v78.23,7.93 79.38,7.93 84.63,13.18 v84.86,13.18 | v86,21.18 85.55,21.18 84.63,22.1 84.18,22.1 78.46,27.81 78.46,29.87 v76.86,31.47
N$32  (via drill 0.61)
  Top 0.254: v36.4,18.21 36.86,17.75 36.86,9.07 42.11,3.81 51.71,3.81 52.63,4.72 R10.2 | v76.17,28.5 76.86,29.18 76.86,29.87 U3.10
  Bottom 0.254: v36.4,18.21 36.4,18.9 38.46,20.95 63.37,20.95 64.52,19.81 67.49,19.81 v76.17,28.5
N$33  (via drill 0.61)
  Top 0.254: v84.18,21.18 84.4,20.95 84.4,18.21 79.15,12.95 79.15,5.41 80.29,4.27 81.66,4.27 82.58,5.18 R11.2 | v77.55,28.5 77.55,29.87 U3.11
  Bottom 0.254: v84.18,21.18 77.55,27.81 v77.55,28.5
N$34  (via drill 0.61)
  Top 0.254: v94.69,32.84 92.86,32.84 86.23,26.21 81.43,26.21 78.46,29.18 78.46,29.87 U3.12
  Bottom 0.254: v94.69,32.84 94.69,33.76 102.69,41.76 U$3.4
N$35  (via drill 0.61)
  Top 0.254: v79.15,32.38 79.15,30.1 U3.13 | v78.23,42.22 79.38,42.22 80.97,43.82 108.64,43.82 110.47,41.99 U$3.7
  Bottom 0.254: v79.15,32.38 79.15,34.21 78.23,35.13 v78.23,42.22
N$36  (via drill 0.61)
  Top 0.254: v80.06,31.47 80.06,30.1 U3.14 | v79.15,41.3 81.2,43.36 106.58,43.36 107.95,41.99 U$3.6
  Bottom 0.254: v80.06,31.47 80.06,33.98 79.15,34.9 v79.15,41.3
N$37  (via drill 0.61)
  Top 0.254: v90.58,25.53 90.58,22.1 91.49,21.18 91.49,8.38 89.66,6.55 89.66,5.41 R17.1 | v81.66,35.59 82.12,36.04 83.03,36.04 U3.23
  Bottom 0.254: v90.58,25.53 84.86,31.24 84.63,31.24 81.66,34.21 v81.66,35.59
N$38
  Top 0.254: SW1.COM1 118.47,22.1 118.47,23.24 120.98,25.76 120.98,31.7 IC2.2 121.21,31.93 121.21,37.87 IC2.4
N$39
  Top 0.254: U$4.12 132.64,42.67 132.64,32.84 130.35,30.56 130.35,26.21 124.41,20.27 123.5,20.27 121.89,18.67 119.15,18.67 118.47,19.36 SW1.CH1B
N$40
  Top 0.254: R17.2 87.83,5.41 87.83,8.84 87.61,9.07 OK7.1
N$41
  Top 0.254: C9.1 29.08,19.36 29.08,14.1 30.23,12.95 SV2.4
N$42
  Top 0.254: U$4.24 134.24,29.64 139.72,24.15 R16.2
N$43
  Top 0.254: R16.1 137.9,24.15 132.64,24.15 LED3.A
N$44  (via drill 3 pad 3.2)
  other vias: 160.56,4.11
N$45  (via drill 3 pad 3.2)
  other vias: 4.1,4.11
N$46  (via drill 3 pad 3.2)
  other vias: 160.56,45.96
N$47  (via drill 3 pad 3.2)
  other vias: 3.85,45.51
N$48  (via drill 3 pad 3.2)
  other vias: 160.81,20.78
N$49  (via drill 3 pad 3.2)
  other vias: 3.6,21.03
RESET  (via drill 0.61)
  Top 0.254: C9.2 30.46,19.58 29.77,20.27 28.17,20.27 26.34,18.44 26.34,8.84 25.65,8.15 SV3.2 | v66.8,46.56 66.8,45.41 R14.1 | v73.89,41.3 75.72,41.3 S1.3 75.95,41.07 76.63,41.07 78.46,39.24 | 78.46,39.24 78.46,38.56 U3.29 | 78.46,39.24 80.29,41.07 80.97,41.07 S1.4
  Bottom 0.254: 67.03,46.56 68.63,46.56 v73.89,41.3 | 67.03,46.56 54.46,33.98 43.94,33.98 24.05,14.1 24.05,11.58 25.43,10.21 25.43,8.15 SV3.2 | 67.03,46.56 v66.8,46.56
RX  (via drill 0.61)
  Top 0.254: v68.4,32.38 68.4,36.5 71.6,39.7 77.09,39.7 77.55,39.24 77.55,38.56 U3.30
  Bottom 0.254: v68.4,32.38 67.72,32.38 66.8,31.47 46.69,31.47 29.08,13.87 29.08,11.58 28.17,10.67 27.48,10.67 25.43,12.72 SV2.2
SCL  (via drill 0.61)
  Top 0.254: v130.81,8.84 131.27,8.38 131.27,7.93 U1.6 | v102.23,15.47 IC3.16 102.23,17.53 100.63,19.13 100.63,22.78 R13.1 | v113.44,35.36 101.78,35.36 97.21,39.93 80.06,39.93 79.38,39.24 79.38,38.56 U3.28
  Bottom 0.254: 129.44,8.84 108.86,8.84 v102.23,15.47 | 129.44,8.84 v130.81,8.84 | v113.44,35.36 129.44,19.36 129.44,8.84
SDA  (via drill 0.61)
  Top 0.254: U1.1 128.3,7.93 117.09,19.13 117.09,25.3 119.84,28.04 119.84,33.3 115.27,33.3 103.61,21.64 103.61,17.53 IC3.15 103.38,17.3 103.38,15.24 102.69,14.55 101.78,14.55 94,22.33 94,22.78 R12.1 93.78,22.78 v91.95,22.78 | v80.06,35.59 80.06,38.33 U3.27
  Bottom 0.254: v80.06,35.59 80.06,34.67 v91.95,22.78
T1
  Top 0.254: OK1.3 45.31,19.58 45.31,38.33 27.03,56.62 17.88,56.62 17.65,56.84 N1.A
T2  (via drill 0.61)
  Top 0.254: v60.63,26.67 60.63,19.58 OK2.3 | v56.74,39.24 v56.74,30.56
  Bottom 0.254: v56.74,30.56 v60.63,26.67 | v56.74,39.24 56.74,43.36 43.26,56.84 N2.A
T3  (via drill 0.61)
  Top 0.254: v64.97,23.01 68.4,19.58 OK3.3 | v51.03,30.56 51.03,33.98 50.57,34.44 50.57,41.76 52.17,43.36 56.74,43.36 59.26,45.87 59.26,48.62 65.89,55.25 67.72,55.25 70.23,57.76 73.89,57.76 74.57,57.07 N3.A
  Bottom 0.254: v64.97,23.01 62.92,23.01 55.37,30.56 v51.03,30.56
T4  (via drill 0.61)
  Top 0.254: v67.03,22.33 72.97,22.33 75.72,19.58 OK4.3 | v55.37,29.18 55.37,32.16 55.83,32.61 v55.83,37.41 | v95.83,47.47 91.72,51.59 91.72,57.53 92.86,58.67 99.72,58.67 101.32,57.07 N4.A
  Bottom 0.254: v67.03,22.33 65.66,22.33 65.43,22.1 62.46,22.1 v55.37,29.18 | v55.83,37.41 56.29,37.41 60.63,41.76 60.63,49.3 61.77,50.44 91.72,50.44 94.69,47.47 v95.83,47.47
T5
  Top 0.254: OK5.3 53.31,19.58 47.14,25.76 46,25.76 45.77,25.98 45.77,43.36 64.29,61.87 68.17,61.87 69.55,60.5 74.12,60.5 75.49,61.87 95.38,61.87 96.29,60.96 99.49,60.96 100.86,62.33 126.01,62.33 130.12,58.22 131.95,58.22 133.1,57.07 N5.A
T6  (via drill 0.61)
  Top 0.254: v81.66,16.84 83.03,18.21 83.03,19.13 OK6.3 | v158.24,52.96 158.24,56.62 158.47,56.84 N6.A
  Bottom 0.254: v81.66,16.84 99.49,16.84 108.41,7.93 131.27,7.93 146.58,23.24 146.58,41.3 v158.24,52.96
TX  (via drill 0.61)
  Top 0.254: v75.95,36.96 76.86,37.87 76.86,38.33 U3.31
  Bottom 0.254: v75.95,36.96 71.6,36.96 66.57,31.93 46.46,31.93 27.94,13.41 27.94,12.95 SV2.3
VBUS  (via drill 0.61)
  Top 0.254: LED1.A 30.68,40.16 30.23,40.16 29.31,41.07 29.31,41.3 28.63,41.99 LED2.A 28.4,42.22 27.71,42.22 26.8,43.13 25.65,43.13 25.2,42.67 25.2,36.5 25.88,35.81 U$2.8 | 25.38,34.95 v28.63,31.7 29.77,30.56 U$2.4 | v24.97,28.04 24.97,26.21 C4.1
  Top 0.406: U2.VBUS1 24.76,34.32 25.38,34.95 U$2.8
  Bottom 0.254: v28.63,31.7 v24.97,28.04

### Text on the board
tPlace: TonyGUO | IN-12 Clock Ver.3 | 2017/07/21